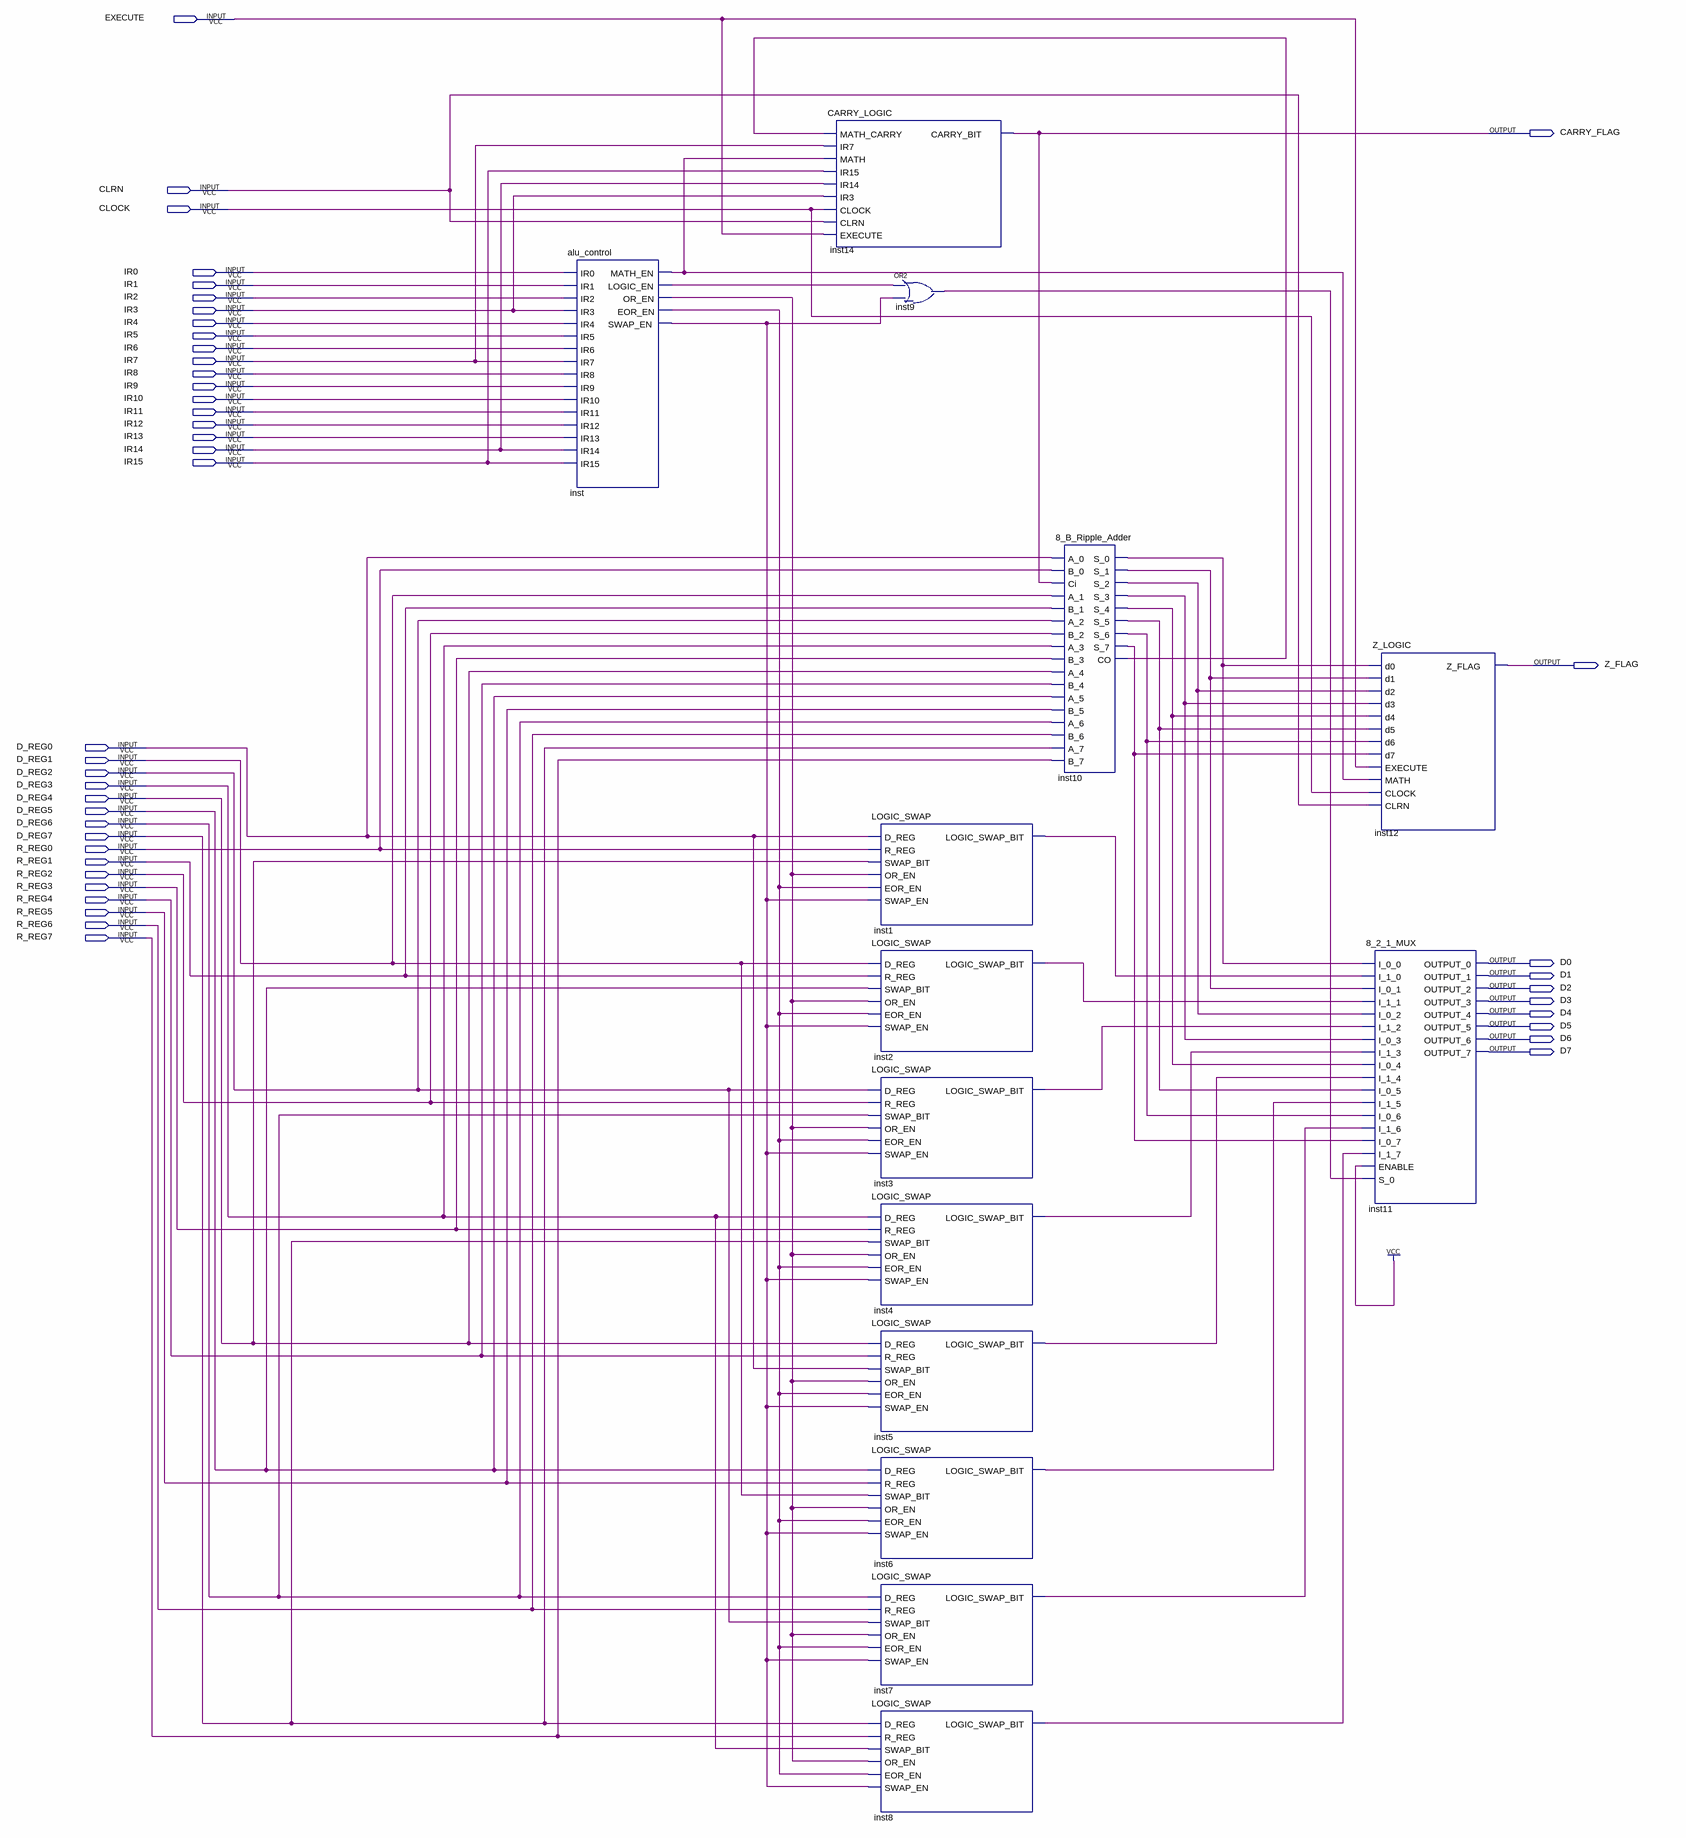
[diagram p0: schematic sheet]
// Quartus schematic ALU_TOP_save.bdf as structural Verilog: 14 symbols, 45 pins
module ALU_TOP_save (
  input  EXECUTE,
  input  CLRN,
  input  CLOCK,
  input  IR0,
  input  IR1,
  input  IR2,
  input  IR3,
  input  IR4,
  input  IR5,
  input  IR6,
  input  IR7,
  input  IR8,
  input  IR9,
  input  IR10,
  input  IR11,
  input  IR12,
  input  IR13,
  input  IR14,
  input  IR15,
  input  D_REG0,
  input  D_REG1,
  input  D_REG2,
  input  D_REG3,
  input  D_REG4,
  input  D_REG5,
  input  D_REG6,
  input  D_REG7,
  input  R_REG0,
  input  R_REG1,
  input  R_REG2,
  input  R_REG3,
  input  R_REG4,
  input  R_REG5,
  input  R_REG6,
  input  R_REG7,
  output CARRY_FLAG,
  output Z_FLAG,
  output D0,
  output D1,
  output D2,
  output D3,
  output D4,
  output D5,
  output D6,
  output D7
);

  wire inst1_logic_swap_bit, inst2_logic_swap_bit, inst3_logic_swap_bit, inst4_logic_swap_bit,
       inst5_logic_swap_bit, inst6_logic_swap_bit, inst7_logic_swap_bit, inst8_logic_swap_bit, inst9_out,
       inst10_co, inst10_s_0, inst10_s_1, inst10_s_2, inst10_s_3, inst10_s_4, inst10_s_5, inst10_s_6,
       inst10_s_7, inst_eor_en, inst_logic_en, inst_math_en, inst_or_en, inst_swap_en;

  alu_control inst (
    .IR0(IR0), .IR1(IR1), .IR2(IR2), .IR3(IR3), .IR4(IR4), .IR5(IR5), .IR6(IR6), .IR7(IR7), .IR8(IR8),
    .IR9(IR9), .IR10(IR10), .IR11(IR11), .IR12(IR12), .IR13(IR13), .IR14(IR14), .IR15(IR15),
    .MATH_EN(inst_math_en), .LOGIC_EN(inst_logic_en), .OR_EN(inst_or_en), .EOR_EN(inst_eor_en),
    .SWAP_EN(inst_swap_en));
  CARRY_LOGIC inst14 (
    .MATH_CARRY(inst10_co), .IR7(IR7), .MATH(inst_math_en), .IR15(IR15), .IR14(IR14), .IR3(IR3),
    .CLOCK(CLOCK), .CLRN(CLRN), .EXECUTE(EXECUTE), .CARRY_BIT(CARRY_FLAG));
  or inst9 (inst9_out, inst_logic_en, inst_swap_en);
  LOGIC_SWAP inst1 (
    .D_REG(D_REG0), .R_REG(R_REG0), .SWAP_BIT(D_REG4), .OR_EN(inst_or_en), .EOR_EN(inst_eor_en),
    .SWAP_EN(inst_swap_en), .LOGIC_SWAP_BIT(inst1_logic_swap_bit));
  LOGIC_SWAP inst2 (
    .D_REG(D_REG1), .R_REG(R_REG1), .SWAP_BIT(D_REG5), .OR_EN(inst_or_en), .EOR_EN(inst_eor_en),
    .SWAP_EN(inst_swap_en), .LOGIC_SWAP_BIT(inst2_logic_swap_bit));
  LOGIC_SWAP inst3 (
    .D_REG(D_REG2), .R_REG(R_REG2), .SWAP_BIT(D_REG6), .OR_EN(inst_or_en), .EOR_EN(inst_eor_en),
    .SWAP_EN(inst_swap_en), .LOGIC_SWAP_BIT(inst3_logic_swap_bit));
  LOGIC_SWAP inst4 (
    .D_REG(D_REG3), .R_REG(R_REG3), .SWAP_BIT(D_REG7), .OR_EN(inst_or_en), .EOR_EN(inst_eor_en),
    .SWAP_EN(inst_swap_en), .LOGIC_SWAP_BIT(inst4_logic_swap_bit));
  LOGIC_SWAP inst5 (
    .D_REG(D_REG4), .R_REG(R_REG4), .SWAP_BIT(D_REG0), .OR_EN(inst_or_en), .EOR_EN(inst_eor_en),
    .SWAP_EN(inst_swap_en), .LOGIC_SWAP_BIT(inst5_logic_swap_bit));
  LOGIC_SWAP inst6 (
    .D_REG(D_REG5), .R_REG(R_REG5), .SWAP_BIT(D_REG1), .OR_EN(inst_or_en), .EOR_EN(inst_eor_en),
    .SWAP_EN(inst_swap_en), .LOGIC_SWAP_BIT(inst6_logic_swap_bit));
  LOGIC_SWAP inst7 (
    .D_REG(D_REG6), .R_REG(R_REG6), .SWAP_BIT(D_REG2), .OR_EN(inst_or_en), .EOR_EN(inst_eor_en),
    .SWAP_EN(inst_swap_en), .LOGIC_SWAP_BIT(inst7_logic_swap_bit));
  LOGIC_SWAP inst8 (
    .D_REG(D_REG7), .R_REG(R_REG7), .SWAP_BIT(D_REG3), .OR_EN(inst_or_en), .EOR_EN(inst_eor_en),
    .SWAP_EN(inst_swap_en), .LOGIC_SWAP_BIT(inst8_logic_swap_bit));
  \8_B_Ripple_Adder  inst10 (
    .A_0(D_REG0), .B_0(R_REG0), .Ci(CARRY_FLAG), .A_1(D_REG1), .B_1(R_REG1), .A_2(D_REG2), .B_2(R_REG2),
    .A_3(D_REG3), .B_3(R_REG3), .A_4(D_REG4), .B_4(R_REG4), .A_5(D_REG5), .B_5(R_REG5), .A_6(D_REG6),
    .B_6(R_REG6), .A_7(D_REG7), .B_7(R_REG7), .S_0(inst10_s_0), .S_1(inst10_s_1), .S_2(inst10_s_2),
    .S_3(inst10_s_3), .S_4(inst10_s_4), .S_5(inst10_s_5), .S_6(inst10_s_6), .S_7(inst10_s_7), .CO(inst10_co));
  \8_2_1_MUX  inst11 (
    .I_0_0(inst10_s_0), .I_1_0(inst1_logic_swap_bit), .I_0_1(inst10_s_1), .I_1_1(inst2_logic_swap_bit),
    .I_0_2(inst10_s_2), .I_1_2(inst3_logic_swap_bit), .I_0_3(inst10_s_3), .I_1_3(inst4_logic_swap_bit),
    .I_0_4(inst10_s_4), .I_1_4(inst5_logic_swap_bit), .I_0_5(inst10_s_5), .I_1_5(inst6_logic_swap_bit),
    .I_0_6(inst10_s_6), .I_1_6(inst7_logic_swap_bit), .I_0_7(inst10_s_7), .I_1_7(inst8_logic_swap_bit),
    .ENABLE(1'b1), .S_0(inst9_out), .OUTPUT_0(D0), .OUTPUT_1(D1), .OUTPUT_2(D2), .OUTPUT_3(D3),
    .OUTPUT_4(D4), .OUTPUT_5(D5), .OUTPUT_6(D6), .OUTPUT_7(D7));
  Z_LOGIC inst12 (
    .d0(inst10_s_0), .d1(inst10_s_1), .d2(inst10_s_2), .d3(inst10_s_3), .d4(inst10_s_4), .d5(inst10_s_5),
    .d6(inst10_s_6), .d7(inst10_s_7), .EXECUTE(EXECUTE), .MATH(inst_math_en), .CLOCK(CLOCK), .CLRN(CLRN),
    .Z_FLAG(Z_FLAG));
endmodule
